# EAGLE design DRON (EAGLE 9.6.2)
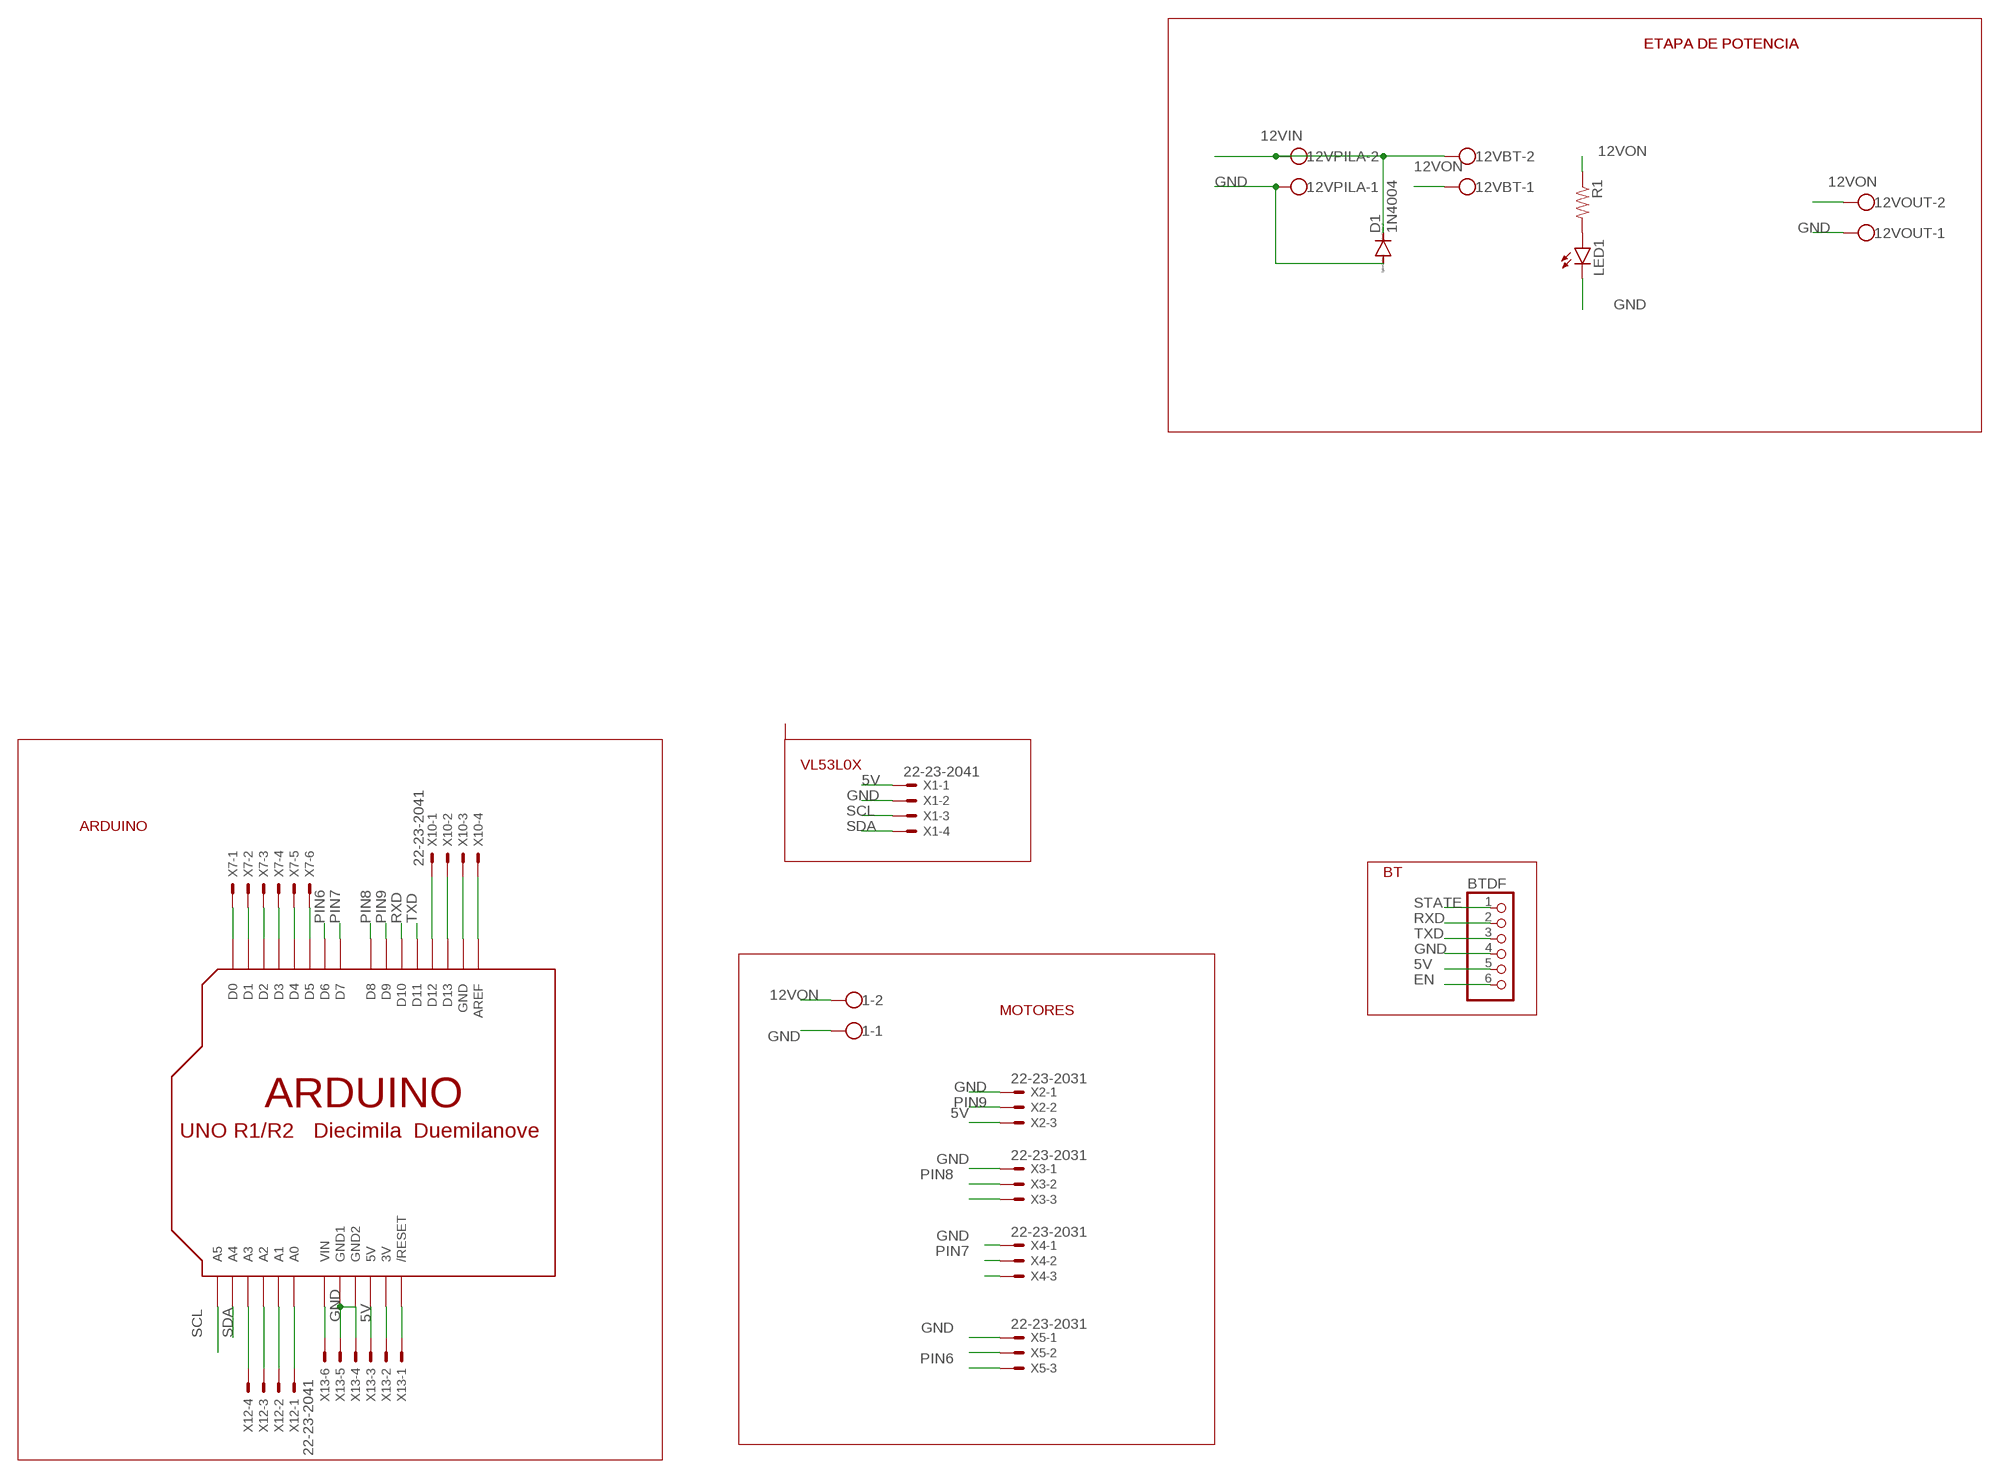
[diagram p0: schematic, sheet 1]

## Parts
1  W237-102  [W237-102]
12VBT  W237-102  [W237-102]
12VOUT  W237-102  [W237-102]
12VPILA  W237-102  [W237-102]
BTDF  PINHD-1X6  [1X06]
D1  1N4004  [DO41-10]
LED1  LED5MM  [LED5MM]
R1  R-US_0204/7  [0204/7]
U$2  ARDUINO-BPLACE  [ARDUINO-BPLACE]
X1  22-23-2041  [22-23-2041]
X2  22-23-2031  [22-23-2031]
X3  22-23-2031  [22-23-2031]
X4  22-23-2031  [22-23-2031]
X5  22-23-2031  [22-23-2031]
X7  22-23-2061  [22-23-2061]
X10  22-23-2041  [22-23-2041]
X12  22-23-2041  [22-23-2041]
X13  22-23-2061  [22-23-2061]

## Nets
5V: BTDF.5 U$2.5V X1.1 X2.3 X13.3
12VIN: 12VBT.2 12VPILA.2 D1.C
12VON: 1.2 12VBT.1 12VOUT.2 R1.1
EN: BTDF.6
GND: 1.1 12VOUT.1 12VPILA.1 BTDF.4 D1.A LED1.K(C) U$2.GND1 U$2.GND2 X1.2 X2.1 X3.1 X4.1 X5.1 X13.4 X13.5
N$1: LED1.A R1.2
N$2: U$2.D0 X7.1
N$18: U$2.D1 X7.2
N$19: U$2.D2 X7.3
N$20: U$2.D3 X7.4
N$23: U$2.D4 X7.5
N$24: U$2.D5 X7.6
N$32: U$2.D12 X10.1
N$33: U$2.D13 X10.2
N$34: U$2.GND X10.3
N$35: X3.3
N$36: U$2.AREF X10.4
N$37: U$2.VIN X13.6
N$38: X4.3
N$41: X5.3
N$42: U$2.3V X13.2
N$43: U$2.RESET(/RESET) X13.1
N$44: U$2.A3 X12.4
N$45: U$2.A2 X12.3
N$46: U$2.A1 X12.2
N$47: U$2.A0 X12.1
PIN6: U$2.D6 X5.2
PIN7: U$2.D7 X4.2
PIN8: U$2.D8 X3.2
PIN9: U$2.D9 X2.2
RXD: BTDF.2 U$2.D10
SCL: U$2.A5 X1.3
SDA: U$2.A4 X1.4
STATE: BTDF.1
TXD: BTDF.3 U$2.D11

## Notes on the sheet
- ETAPA DE POTENCIA | ETAPA DE POTENCIA
- VL53L0X
- ARDUINO
- BT
- MOTORES

## Library data of the parts
1 12VBT 12VOUT 12VPILA = con-wago-500:W237-102: WAGO SCREW CLAMP; MPN: 237-102; OC_FARNELL: unknown; OC_NEWARK: 70K9898
BTDF = adafruit:PINHD-1X6: PIN HEADER
D1 = diode:1N4004: DIODE general purpose rectifier, 1 A
LED1 = led:LED: LED OSRAM: - CHIPLED LG R971, LG N971, LY N971, LG Q971, LY Q971, LO R971, LY R971 LH N974, LH R974 LS Q976, LO Q976, LY Q976 LO Q996 - Hyper CHIPLED LW Q18S LB Q993, LB Q99A, LB R99A - SideLED LS A670, LO A670, LY A670, LG A670, LP A670 LB A673, LV A673, LT A673, LW A673 LH A674 LY A675 LS A676, LA A676, LO A676, LY A676, LW A676 LS A679, LY A679, LG A679 - Hyper Micro SIDELED® LS Y876, LA Y876, LO Y876, LY Y876 LT Y87S - SmartLED LW L88C, LW L88S LB L89C, LB L89S, LG L890 LS L89K, LO L89K, LY L89K LS L896, LA L896, LO L896, LY L896 - TOPLED LS T670, LO T670, LY T670, LG T670, LP T670 LSG T670, LSP T670, LSY T670, LOP T670, LYG T670 LG T671, LOG T671, LSG T671 LB T673, LV T673, LT T673, LW T673 LH T674 LS T676, LA T676, LO T676, LY T676, LB T676, LH T676, LSB T676, LW T676 LB T67C, LV T67C, LT T67C, LS T67K, LO T67K, LY T67K, LW E67C LS E67B, LA E67B, LO E67B, LY E67B, LB E67C, LV E67C, LT E67C LW T67C LS T679, LY T679, LG T679 LS T770, LO T770, LY T770, LG T770, LP T770 LB T773, LV T773, LT T773, LW T773 LH T774 LS E675, LA E675, LY E675, LS T675 LS T776, LA T776, LO T776, LY T776, LB T776 LHGB T686 LT T68C, LB T68C - Hyper Mini TOPLED® LB M676 - Mini TOPLED Santana® LG M470 LS M47K, LO M47K, LY M47K Source: http://www.osram.convergy.de LUXEON: - LUMILED® LXK2-PW12-R00, LXK2-PW12-S00, LXK2-PW14-U00, LXK2-PW14-V00 LXK2-PM12-R00, LXK2-PM12-S00, LXK2-PM14-U00 LXK2-PE12-Q00, LXK2-PE12-R00, LXK2-PE12-S00, LXK2-PE14-T00, LXK2-PE14-U00 LXK2-PB12-K00, LXK2-PB12-L00, LXK2-PB12-M00, LXK2-PB14-N00, LXK2-PB14-P00, LXK2-PB14-Q00 LXK2-PR12-L00, LXK2-PR12-M00, LXK2-PR14-Q00, LXK2-PR14-R00 LXK2-PD12-Q00, LXK2-PD12-R00, LXK2-PD12-S00 LXK2-PH12-R00, LXK2-PH12-S00 LXK2-PL12-P00, LXK2-PL12-Q00, LXK2-PL12-R00 Source: www.luxeon.com KINGBRIGHT: KA-3528ASYC Source: www.kingbright.com
R1 = rcl:R-US_: RESISTOR, American symbol; SPICEPREFIX: R
U$2 = adafruit:ARDUINO: Arduino Diecimila/Duemilanove Make a shield with ease, this package has all the named pins as well as the two mounting drill holes and an outline of the USB and DC power connector. The outline is on the DIMENSION layer, so if your board house uses it they will cut the outline to match. http://www.ladyada.net/library/pcb/eaglelibrary.html
X1 X10 X12 = con-molex:22-23-2041: .100" (2.54mm) Center Header - 4 Pin; MF: MOLEX; MPN: 22-23-2041; OC_FARNELL: 1462920; OC_NEWARK: 38C0355
X2-X5 = con-molex:22-23-2031: .100" (2.54mm) Center Header - 3 Pin; MF: MOLEX; MPN: 22-23-2031; OC_FARNELL: 1462950; OC_NEWARK: 30C0862
X7 X13 = con-molex:22-23-2061: .100" (2.54mm) Center Header - 6 Pin; MF: MOLEX; MPN: 22-23-2061; OC_FARNELL: 1462922; OC_NEWARK: 27C1933

## Board
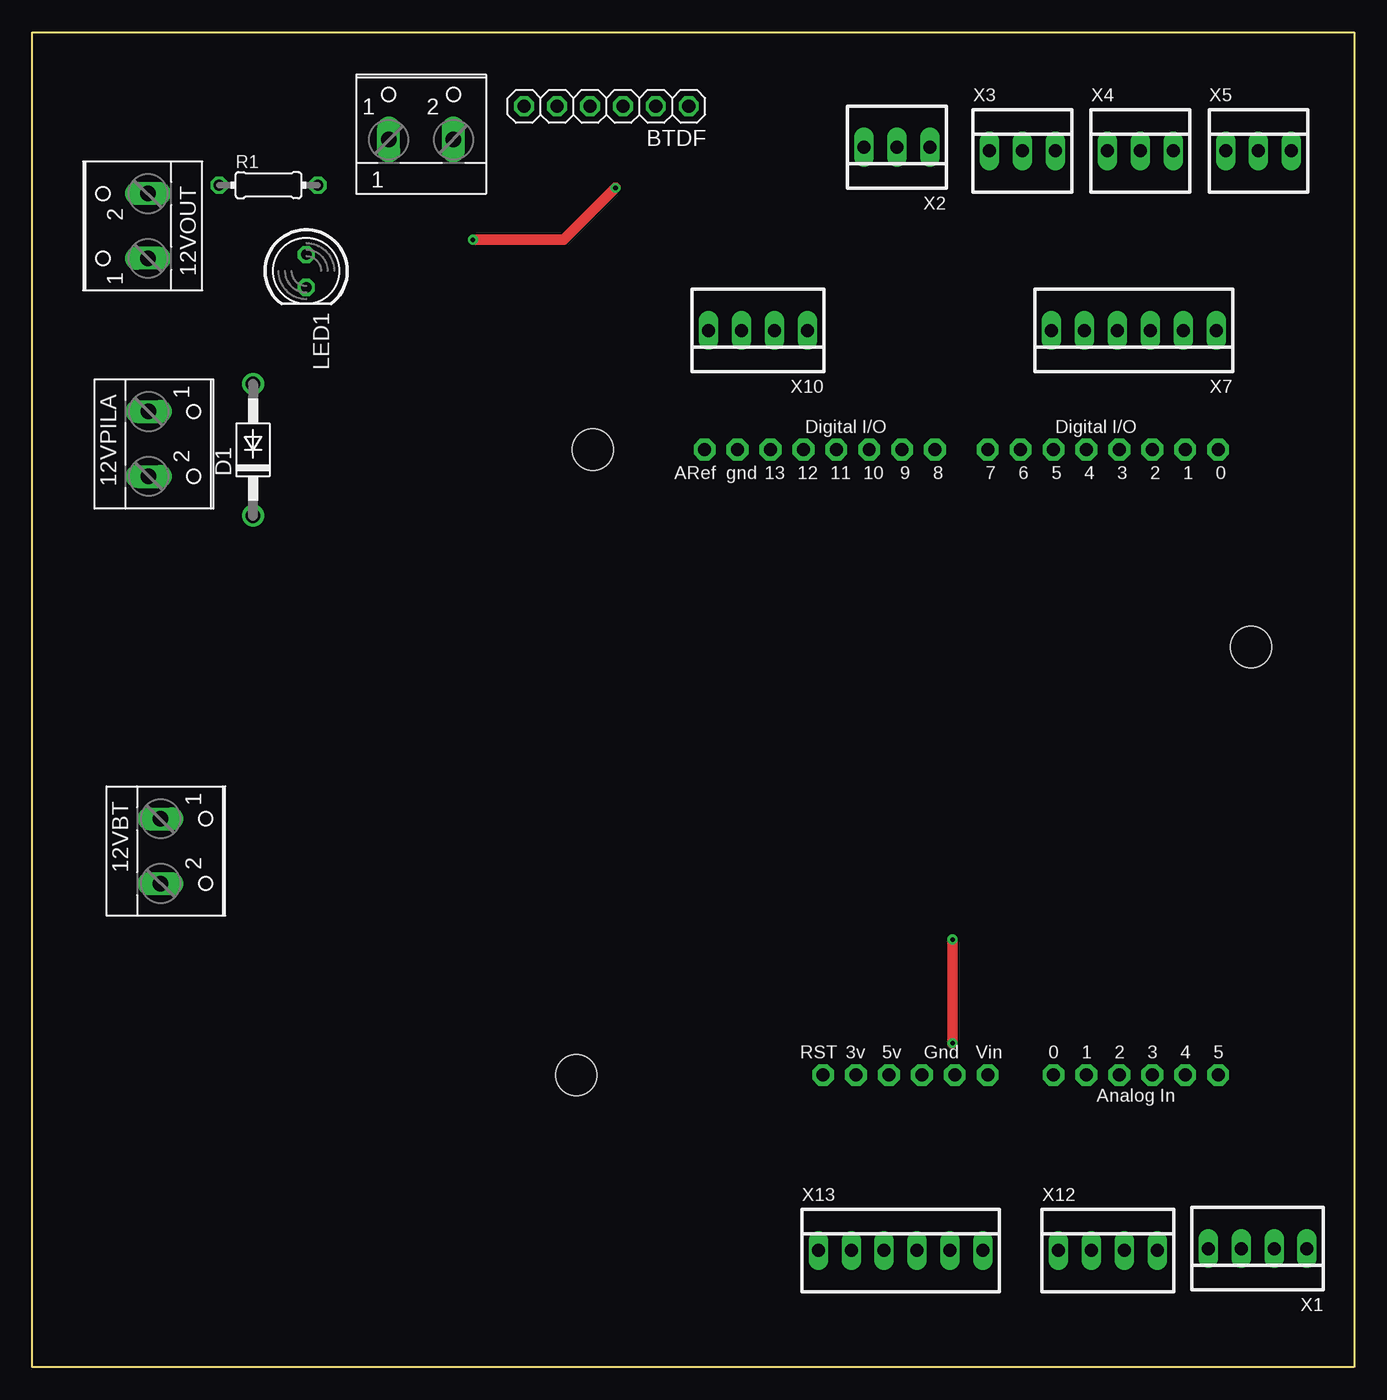
[diagram p1: board, top side]
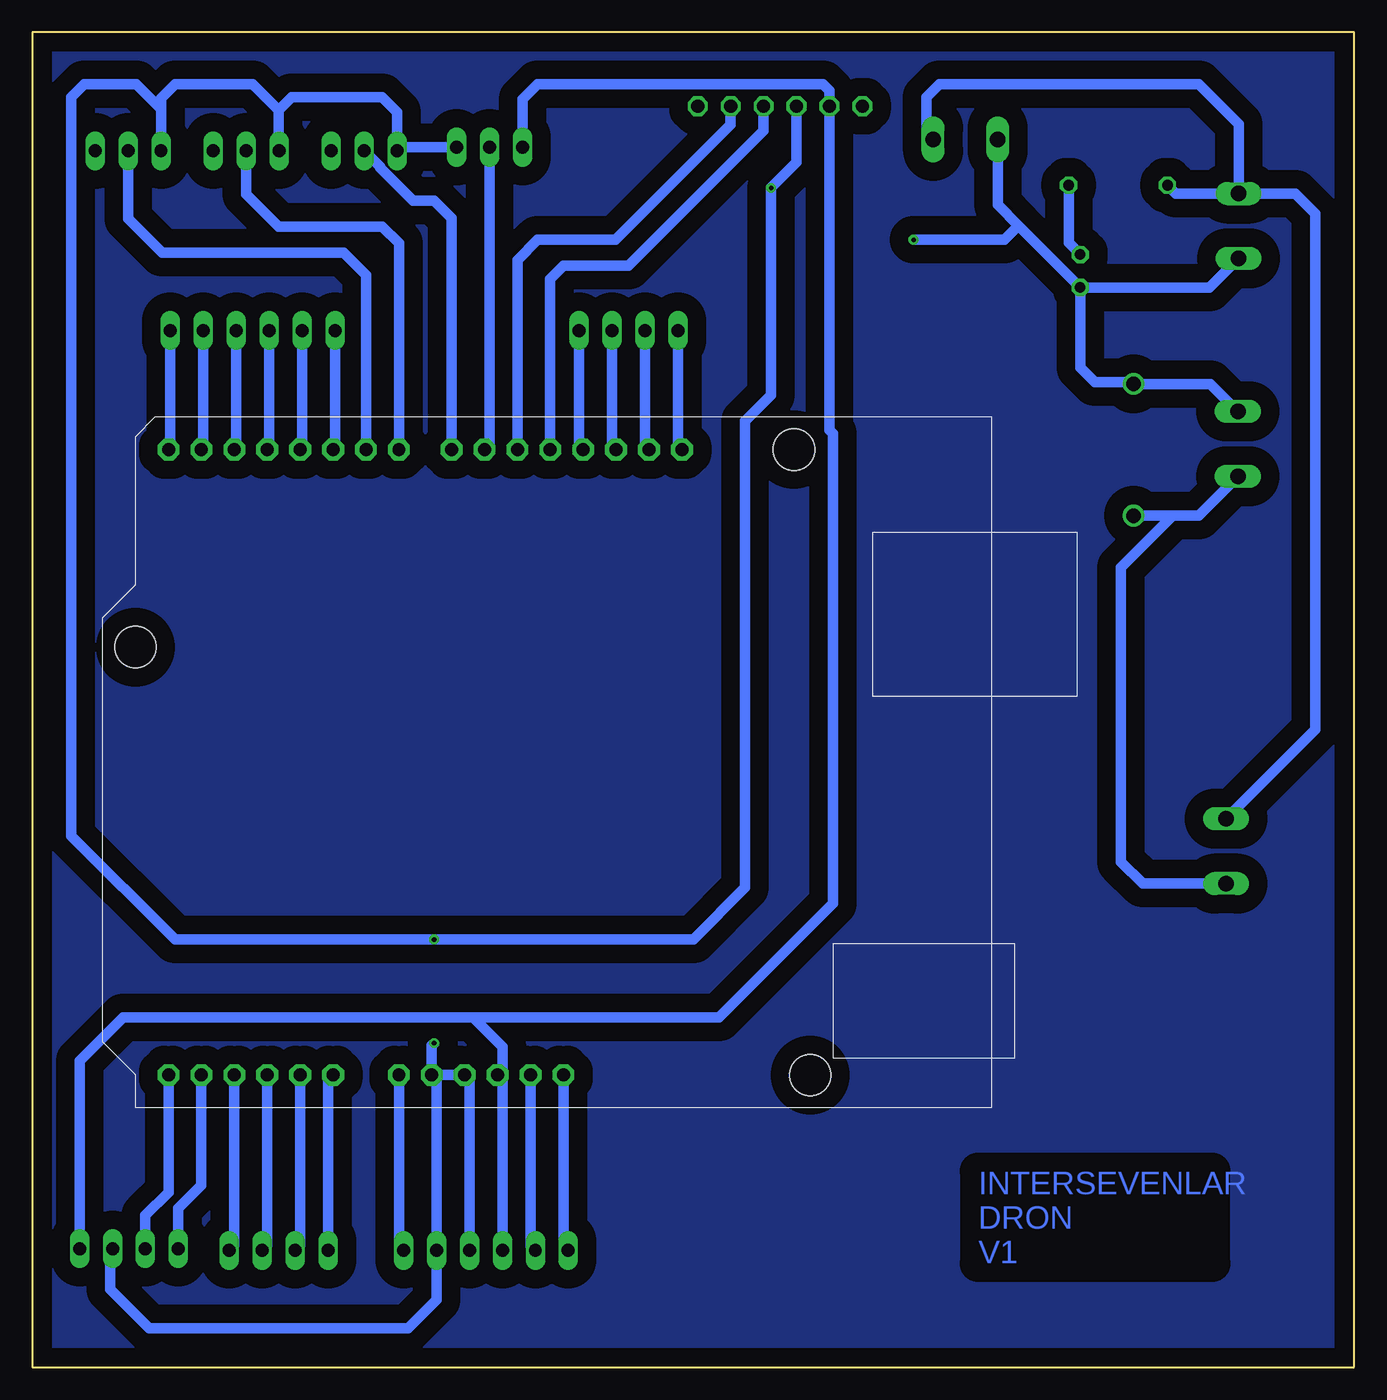
[diagram p2: board, bottom side, seen from below]

Size 102 x 103 mm. Coordinates in mm from the lower left corner, seen from the top.
Outline: 0,103 102,103 102,0 0,0 0,103
Copper layers (1*16): Top 0.035mm / dielectric 1.5mm / Bottom 0.035mm
Design rules "default": minimum track width 6mil, minimum drill 0.35mm, track to track 6mil, track to pad 6mil, pad to pad 6mil, via to via 6mil, smd to smd 6mil, copper to edge 40mil, drill to drill 6mil, minimum pad ring 10mil, minimum via ring 8mil, stop-mask expansion 4mil, vias tented up to drill 0mil, thermal gap 10mil

### Footprints (pad centres in the part's own frame; a part is rotated, then mirrored left to right if it is on the bottom)
W237-102 = drill 1.194 long: 1 -2.5,-1.27; 2 2.5,-1.27
1X06 = drill 1.016 octagon: 1 -6.35,0; 2 -3.81,0; 3 -1.27,0; 4 1.27,0; 5 3.81,0; 6 6.35,0
DO41-10 = drill 1.118: A 5.08,0; C -5.08,0
LED5MM = drill 0.813 octagon: A -1.27,0; K 1.27,0
0204/7 = drill 0.813 octagon: 1 -3.81,0; 2 3.81,0
ARDUINO-BPLACE = drill 1 pad 1.676 octagon: 3V 35.56,2.54; 5V 38.1,2.54; A0 50.8,2.54; A1 53.34,2.54; A2 55.88,2.54; A3 58.42,2.54; A4 60.96,2.54; A5 63.5,2.54; AREF 23.876,50.8; D0 63.5,50.8; D1 60.96,50.8; D2 58.42,50.8; D3 55.88,50.8; D4 53.34,50.8; D5 50.8,50.8; D6 48.26,50.8; D7 45.72,50.8; D8 41.656,50.8; D9 39.116,50.8; D10 36.576,50.8; D11 34.036,50.8; D12 31.496,50.8; D13 28.956,50.8; GND 26.416,50.8; GND1 43.18,2.54; GND2 40.64,2.54; RESET 33.02,2.54; VIN 45.72,2.54 | hole 3.2: 15.24,50.8; 66.04,35.56; 13.97,2.54
22-23-2041 = drill 1 long: 1 -3.81,0; 2 -1.27,0; 3 1.27,0; 4 3.81,0
22-23-2031 = drill 1 long: 1 -2.54,0; 2 0,0; 3 2.54,0
22-23-2061 = drill 1 long: 1 -6.35,0; 2 -3.81,0; 3 -1.27,0; 4 1.27,0; 5 3.81,0; 6 6.35,0

### Placement (x,y rotation side)
1  30,96 0 top
12VBT  11.16,39.82 270 top
12VOUT  7.65,88.06 90 top
12VPILA  10.24,71.24 270 top
BTDF  44.3,97.3 180 top
D1  17.03,70.79 90 top
LED1  21.13,84.59 270 top
R1  18.22,91.21 0 top
U$2  28,20 0 top
X1  94.55,9.14 180 top
X2  66.71,94.14 180 top
X3  76.4,93.86 0 top
X4  85.51,93.86 0 top
X5  94.62,93.86 0 top
X7  85,80 180 top
X10  56,80 180 top
X12  83,9 0 top
X13  67,9 0 top

### Tracks (layer width: path | path; a pad name or v marks a point on that pad's centre or on a via)
5V
  Bottom 0.813: 65.73,22.17 U$2.5V 66,22.64 | 65.73,22.17 X13.3 | X1.1 98.36,23.64 95,27 68,27 | X2.3 64.17,97.83 63,99 41,99 40.49,98.49 BTDF.5 40.49,72.32 40.22,72.05 40.22,35.78 49,27 68,27 | 68,27 65.73,24.73 65.73,22.17
12VIN
  Bottom 0.813: 12VPILA.2 12,65.71 14,65.71 | 14,65.71 D1.C | 12VBT.2 16.32,37.32 18,39 18,61.71 14,65.71
12VON
  Bottom 0.813: 12VOUT.2 13.76,90.56 R1.1 | 12VOUT.2 8.92,95.92 12,99 32,99 33,98 33,95.23 1.2 | 12VBT.1 3,49.21 3,89 4.56,90.56 12VOUT.2
GND  (via drill 0.35)
  Top 0.813: v45,91 41,87 v34,87 | v71,33 v71,25
  Bottom 0.813: U$2.GND1 U$2.GND2 68.27,22.17 X13.4 | U$2.GND1 70.81,22.17 X13.5 70.81,5.19 73,3 93,3 96,6 96,8.96 X1.2 | 83,97 82,98 75,98 73.86,96.86 X3.1 73.58,94.14 X2.1 | 83,97 83,93.89 X4.1 | 83,97 85,99 91,99 92.08,97.92 X5.1 92.08,97.08 94,99 98,99 99,98 99,41 91,33 73,33 v71,33 51,33 47,37 47,73 45,75 v45,91 43.03,92.97 BTDF.4 | 12VOUT.1 11.16,83.32 LED1.K | 1.1 27.5,89.69 25.91,88.09 | 25.91,88.09 LED1.K | 12VPILA.1 11.1,75.87 D1.A 17.16,76 20,76 21.13,77.13 LED1.K | v71,25 71.18,24.82 U$2.GND1 | 25.91,88.09 27,87 v34,87
N$1
  Bottom 0.813: R1.2 22.03,86.76 LED1.A
N$2
  Bottom 0.813: X7.1 91.35,70.95 U$2.D0
N$15
  pour Bottom (isolate 1.422): 0,0 102,0 102,103 0,103
N$18
  Bottom 0.813: X7.2 88.81,70.95 U$2.D1
N$19
  Bottom 0.813: X7.3 86.27,70.95 U$2.D2
N$20
  Bottom 0.813: X7.4 83.73,70.95 U$2.D3
N$23
  Bottom 0.813: X7.5 81.19,70.95 U$2.D4
N$24
  Bottom 0.813: X7.6 78.65,70.95 U$2.D5
N$32
  Bottom 0.813: X10.1 59.81,71.11 U$2.D12
N$33
  Bottom 0.813: X10.2 57.27,71.11 U$2.D13
N$34
  Bottom 0.813: X10.3 54.73,71.11 U$2.GND
N$36
  Bottom 0.813: X10.4 52.19,71.11 U$2.AREF
N$37
  Bottom 0.813: U$2.VIN 73.72,9.37 X13.6
N$42
  Bottom 0.813: U$2.3V 63.56,9.37 X13.2
N$43
  Bottom 0.813: U$2.RESET 61.02,9.37 X13.1
N$44
  Bottom 0.813: U$2.A3 86.42,9.39 X12.4
N$45
  Bottom 0.813: U$2.A2 83.88,9.39 X12.3
N$46
  Bottom 0.813: U$2.A1 81.34,9.39 X12.2
N$47
  Bottom 0.813: U$2.A0 79.19,22.15 X12.1
PIN6
  Bottom 0.813: X5.2 94.62,88.62 92,86 78,86 76.26,84.26 U$2.D6
PIN7
  Bottom 0.813: X4.2 85.51,90.51 83,88 75,88 73.72,86.72 U$2.D7
PIN8
  Bottom 0.813: X3.2 75.17,92.63 75.17,92.56 72.61,90 71,90 69.66,88.66 U$2.D8
PIN9
  Bottom 0.813: X2.2 66.71,71.21 U$2.D9
RXD
  Bottom 0.813: U$2.D10 64.58,85.42 63,87 57,87 48.11,95.89 BTDF.2
SCL
  Bottom 0.813: U$2.A5 91.5,13.5 93.28,11.72 X1.3
SDA
  Bottom 0.813: U$2.A4 88.96,14.04 90.74,12.26 X1.4
TXD
  Bottom 0.813: U$2.D11 62.04,83.96 61,85 56,85 54,87 53.57,87.43 45.57,95.43 BTDF.3

### Text on the board
Bottom: INTERSEVENLAR / DRON / V1